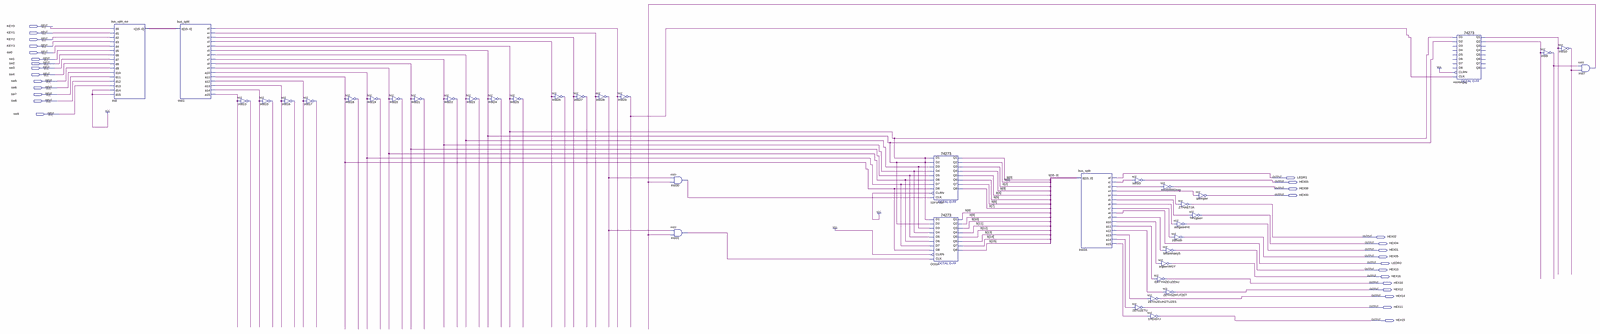
[diagram p0: schematic sheet, whole]
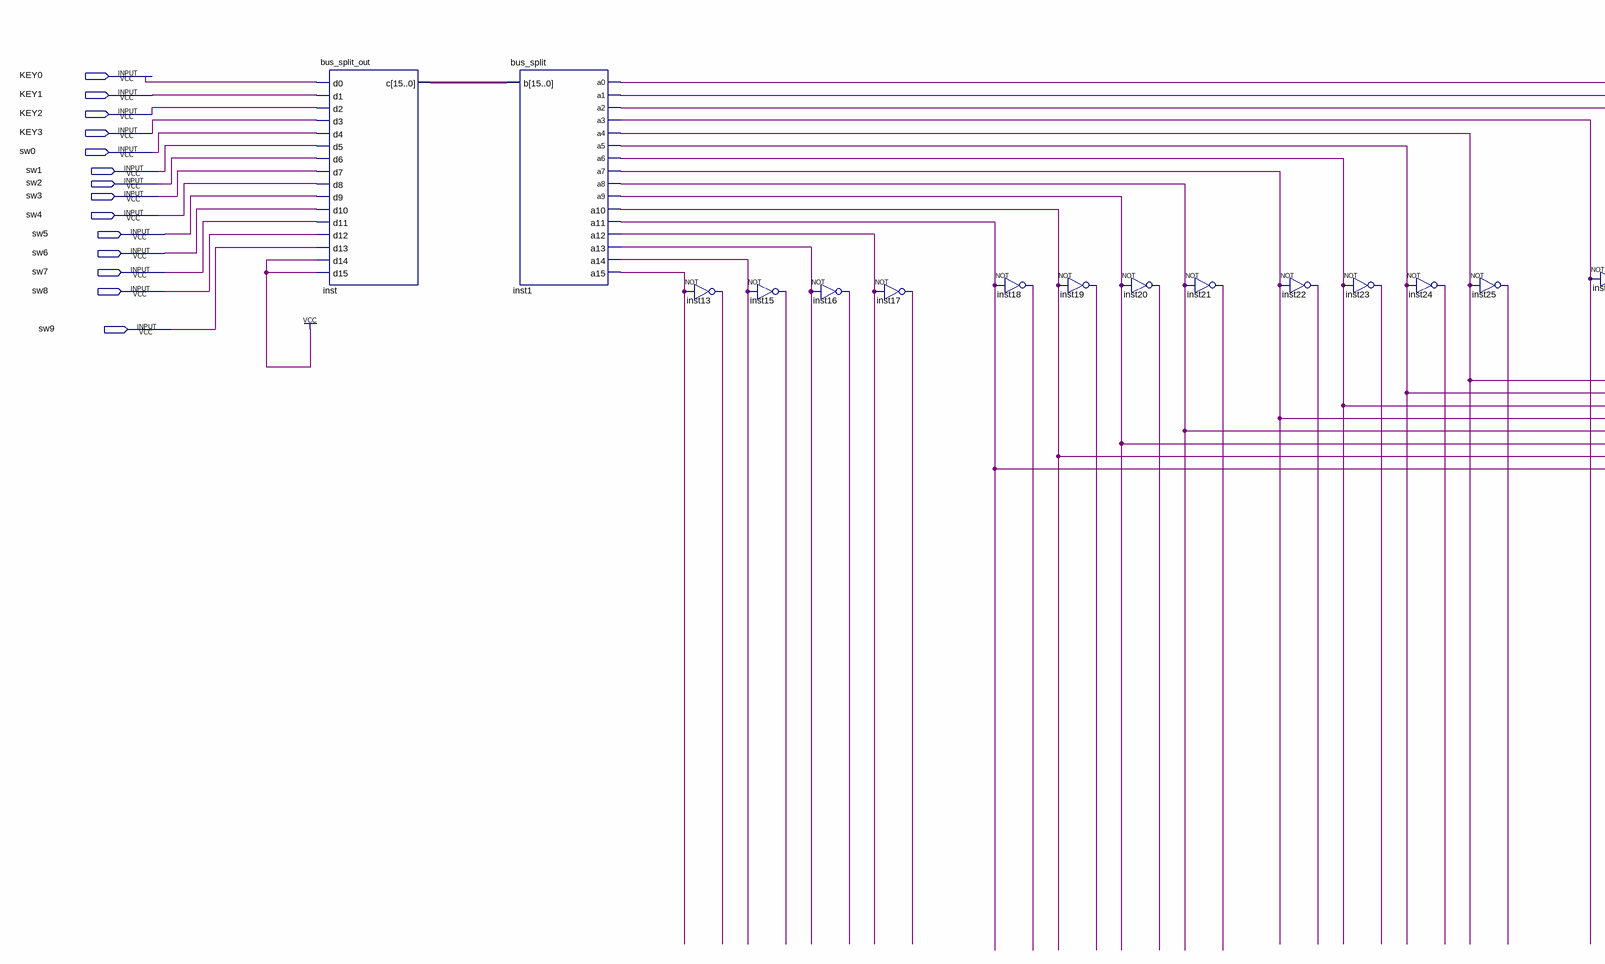
[diagram p1: schematic sheet, left part]
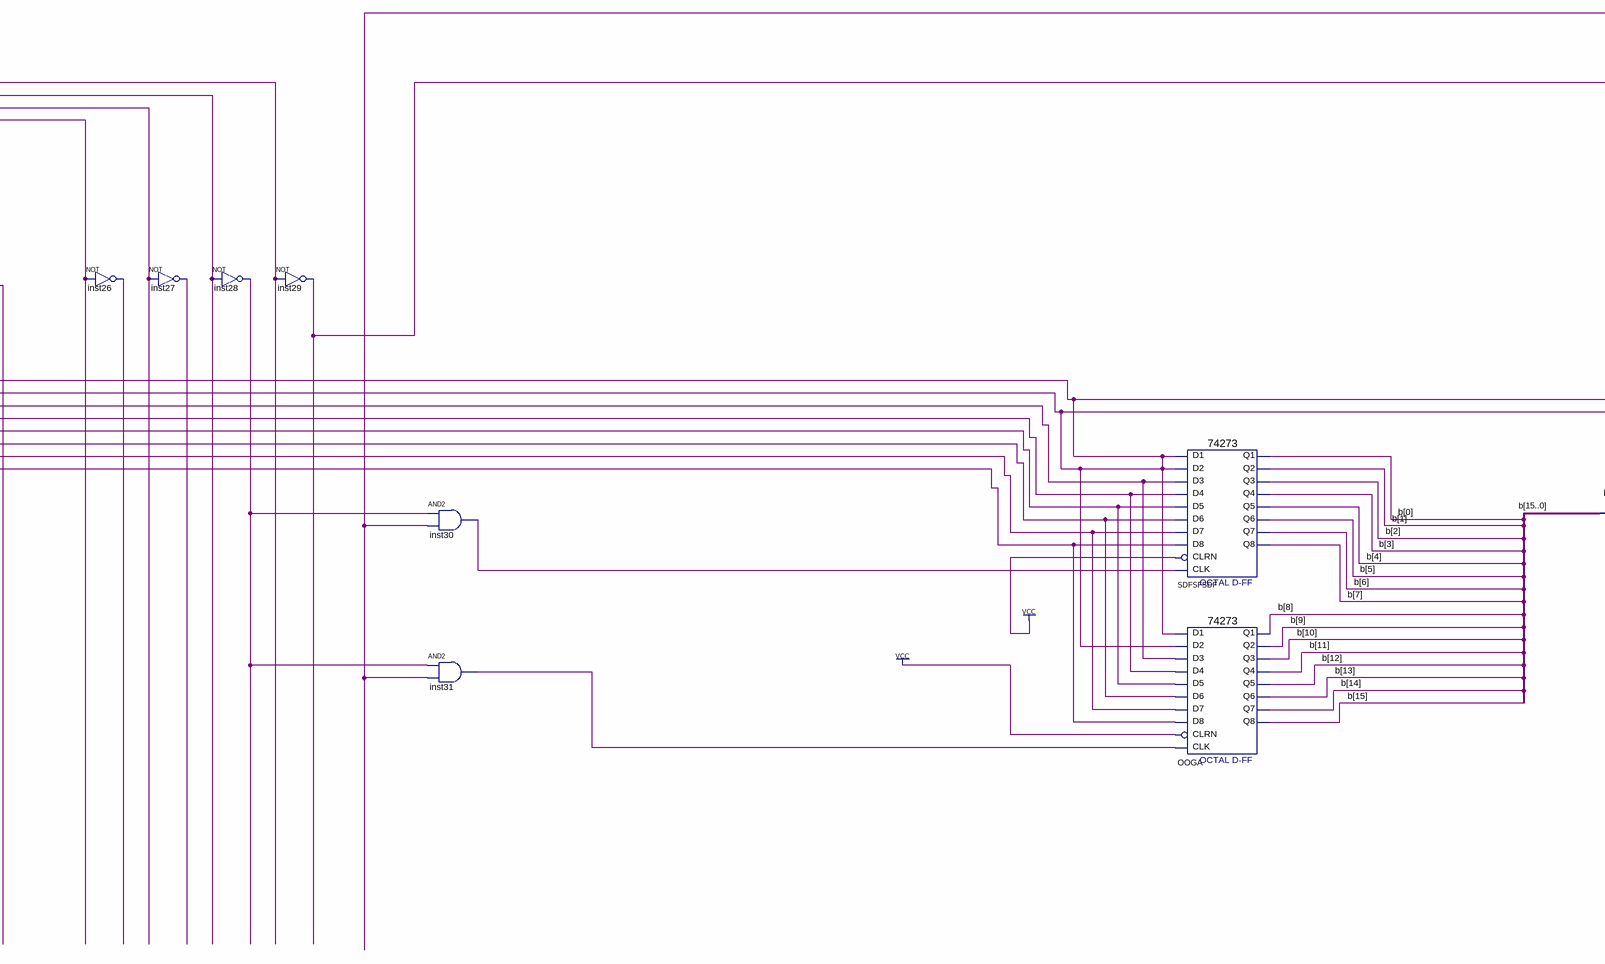
[diagram p2: schematic sheet, centre part]
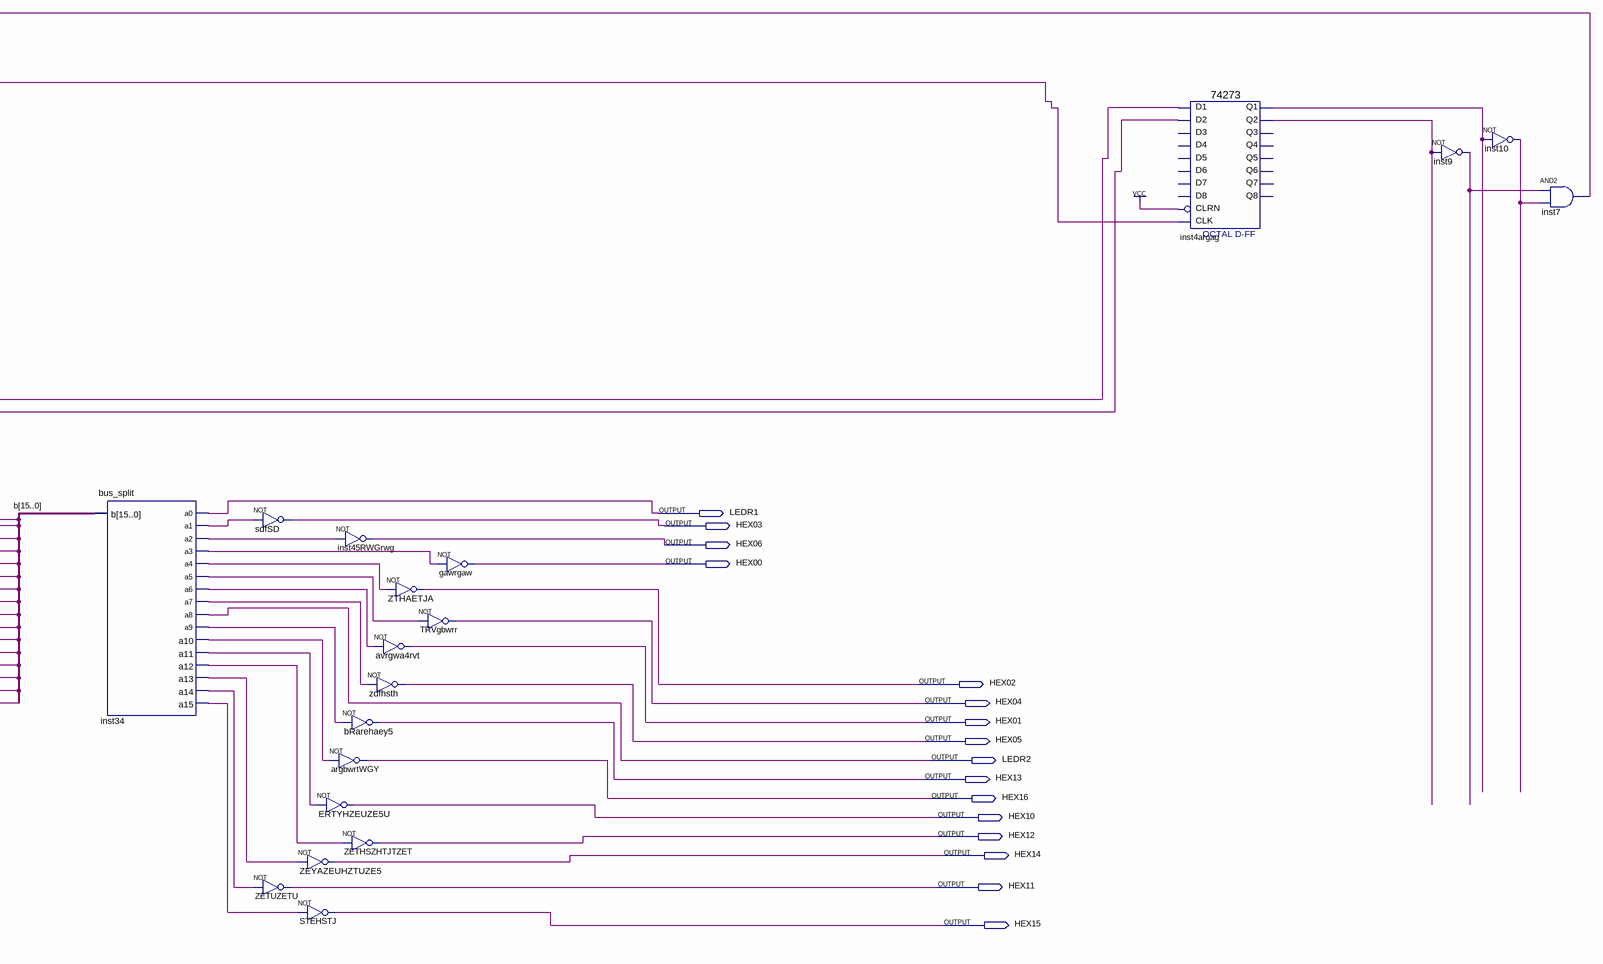
[diagram p3: schematic sheet, right part]
// Quartus schematic in_mod.bdf as structural Verilog: 41 symbols, 30 pins
module in_mod (
  input  KEY0,
  input  KEY1,
  input  KEY2,
  input  KEY3,
  input  sw0,
  input  sw1,
  input  sw2,
  input  sw3,
  input  sw4,
  input  sw5,
  input  sw6,
  input  sw7,
  input  sw8,
  input  sw9,
  output LEDR1,
  output HEX03,
  output HEX06,
  output HEX00,
  output HEX02,
  output HEX04,
  output HEX01,
  output HEX05,
  output LEDR2,
  output HEX13,
  output HEX16,
  output HEX10,
  output HEX12,
  output HEX14,
  output HEX11,
  output HEX15
);

  wire inst1_a0, inst1_a1, inst1_a2, inst1_a3, inst1_a4, inst1_a6, inst1_a7, inst1_a8, inst1_a9, inst1_a10,
       inst1_a11, inst1_a12, inst1_a13, inst1_a14, inst1_a15, inst4argag_q1, inst4argag_q2, inst7_out,
       inst9_out, inst10_out, inst13_out, inst15_out, inst16_out, inst17_out, inst18_out, inst19_out,
       inst20_out, inst21_out, inst22_out, inst23_out, inst24_out, inst25_out, inst26_out, inst27_out,
       inst28_out, inst29_out, inst30_out, inst31_out, inst34_a1, inst34_a2, inst34_a3, inst34_a4, inst34_a5,
       inst34_a6, inst34_a7, inst34_a9, inst34_a10, inst34_a11, inst34_a12, inst34_a13, inst34_a14,
       inst34_a15;
  wire [15:0] b, inst_c;

  bus_split_out inst (
    .d0(KEY0), .d1(KEY1), .d2(KEY2), .d3(KEY3), .d4(sw0), .d5(sw1), .d6(sw2), .d7(sw3), .d8(sw4), .d9(sw5),
    .d10(sw6), .d11(sw7), .d12(sw8), .d13(sw9), .d14(1'b1), .d15(1'b1), .c(inst_c));
  bus_split inst1 (
    .b(inst_c), .a0(inst1_a0), .a1(inst1_a1), .a2(inst1_a2), .a3(inst1_a3), .a4(inst1_a4), .a5(inst1_a4),
    .a6(inst1_a6), .a7(inst1_a7), .a8(inst1_a8), .a9(inst1_a9), .a10(inst1_a10), .a11(inst1_a11),
    .a12(inst1_a12), .a13(inst1_a13), .a14(inst1_a14), .a15(inst1_a15));
  not inst13 (inst13_out, inst1_a15);
  not inst15 (inst15_out, inst1_a14);
  not inst16 (inst16_out, inst1_a13);
  not inst17 (inst17_out, inst1_a12);
  not inst18 (inst18_out, inst1_a11);
  not inst19 (inst19_out, inst1_a10);
  not inst20 (inst20_out, inst1_a9);
  not inst21 (inst21_out, inst1_a8);
  not inst22 (inst22_out, inst1_a7);
  not inst23 (inst23_out, inst1_a6);
  not inst24 (inst24_out, inst1_a4);
  not inst25 (inst25_out, inst1_a4);
  not inst26 (inst26_out, inst1_a3);
  not inst27 (inst27_out, inst1_a2);
  not inst28 (inst28_out, inst1_a1);
  not inst29 (inst29_out, inst1_a0);
  and inst30 (inst30_out, inst28_out, inst7_out);
  and inst31 (inst31_out, inst28_out, inst7_out);
  \74273  SDFSFSDF (
    .D2(inst1_a4), .D3(inst1_a6), .D1(inst1_a4), .D4(inst1_a7), .D7(inst1_a10), .D6(inst1_a9), .D5(inst1_a8),
    .D8(inst1_a11), .CLK(inst30_out), .CLRN(1'b1), .Q4(b[3]), .Q1(b[0]), .Q2(b[1]), .Q3(b[2]), .Q6(b[5]),
    .Q5(b[4]), .Q7(b[6]), .Q8(b[7]));
  \74273  OOGA (
    .D2(inst1_a4), .D3(inst1_a6), .D1(inst1_a4), .D4(inst1_a7), .D7(inst1_a10), .D6(inst1_a9), .D5(inst1_a8),
    .D8(inst1_a11), .CLK(inst31_out), .CLRN(1'b1), .Q4(b[11]), .Q1(b[8]), .Q2(b[9]), .Q3(b[10]), .Q6(b[13]),
    .Q5(b[12]), .Q7(b[14]), .Q8(b[15]));
  bus_split inst34 (
    .b(b), .a0(LEDR1), .a1(inst34_a1), .a2(inst34_a2), .a3(inst34_a3), .a4(inst34_a4), .a5(inst34_a5),
    .a6(inst34_a6), .a7(inst34_a7), .a8(LEDR2), .a9(inst34_a9), .a10(inst34_a10), .a11(inst34_a11),
    .a12(inst34_a12), .a13(inst34_a13), .a14(inst34_a14), .a15(inst34_a15));
  not sdfSD (HEX03, inst34_a1);
  not ZETUZETU (HEX11, inst34_a14);
  not ZEYAZEUHZTUZE5 (HEX14, inst34_a13);
  not STEHSTJ (HEX15, inst34_a15);
  not inst45RWGrwg (HEX06, inst34_a2);
  not bRarehaey5 (HEX13, inst34_a9);
  not argbwrtWGY (HEX16, inst34_a10);
  not ERTYHZEUZE5U (HEX10, inst34_a11);
  not ZETHSZHTJTZET (HEX12, inst34_a12);
  not ZTHAETJA (HEX02, inst34_a4);
  not avrgwa4rvt (HEX01, inst34_a6);
  not zdfhsth (HEX05, inst34_a7);
  not gawrgaw (HEX00, inst34_a3);
  not TRVgbwrr (HEX04, inst34_a5);
  \74273  inst4argag (
    .D2(inst1_a4), .D1(inst1_a4), .CLK(inst29_out), .CLRN(1'b1), .Q1(inst4argag_q1), .Q2(inst4argag_q2));  // open: D3, D4, D7, D6, D5, D8, Q4, Q3, Q6, Q5, Q7, Q8
  not inst9 (inst9_out, inst4argag_q2);
  not inst10 (inst10_out, inst4argag_q1);
  and inst7 (inst7_out, inst9_out, inst10_out);
endmodule
